# EasyEDA schematic SCH_BMS_1_2022-05-24.json
TITLE: Sheet_1; REV: 1.0; Date: 2021-11-02; Sheet: 1/1; Company: Your Company
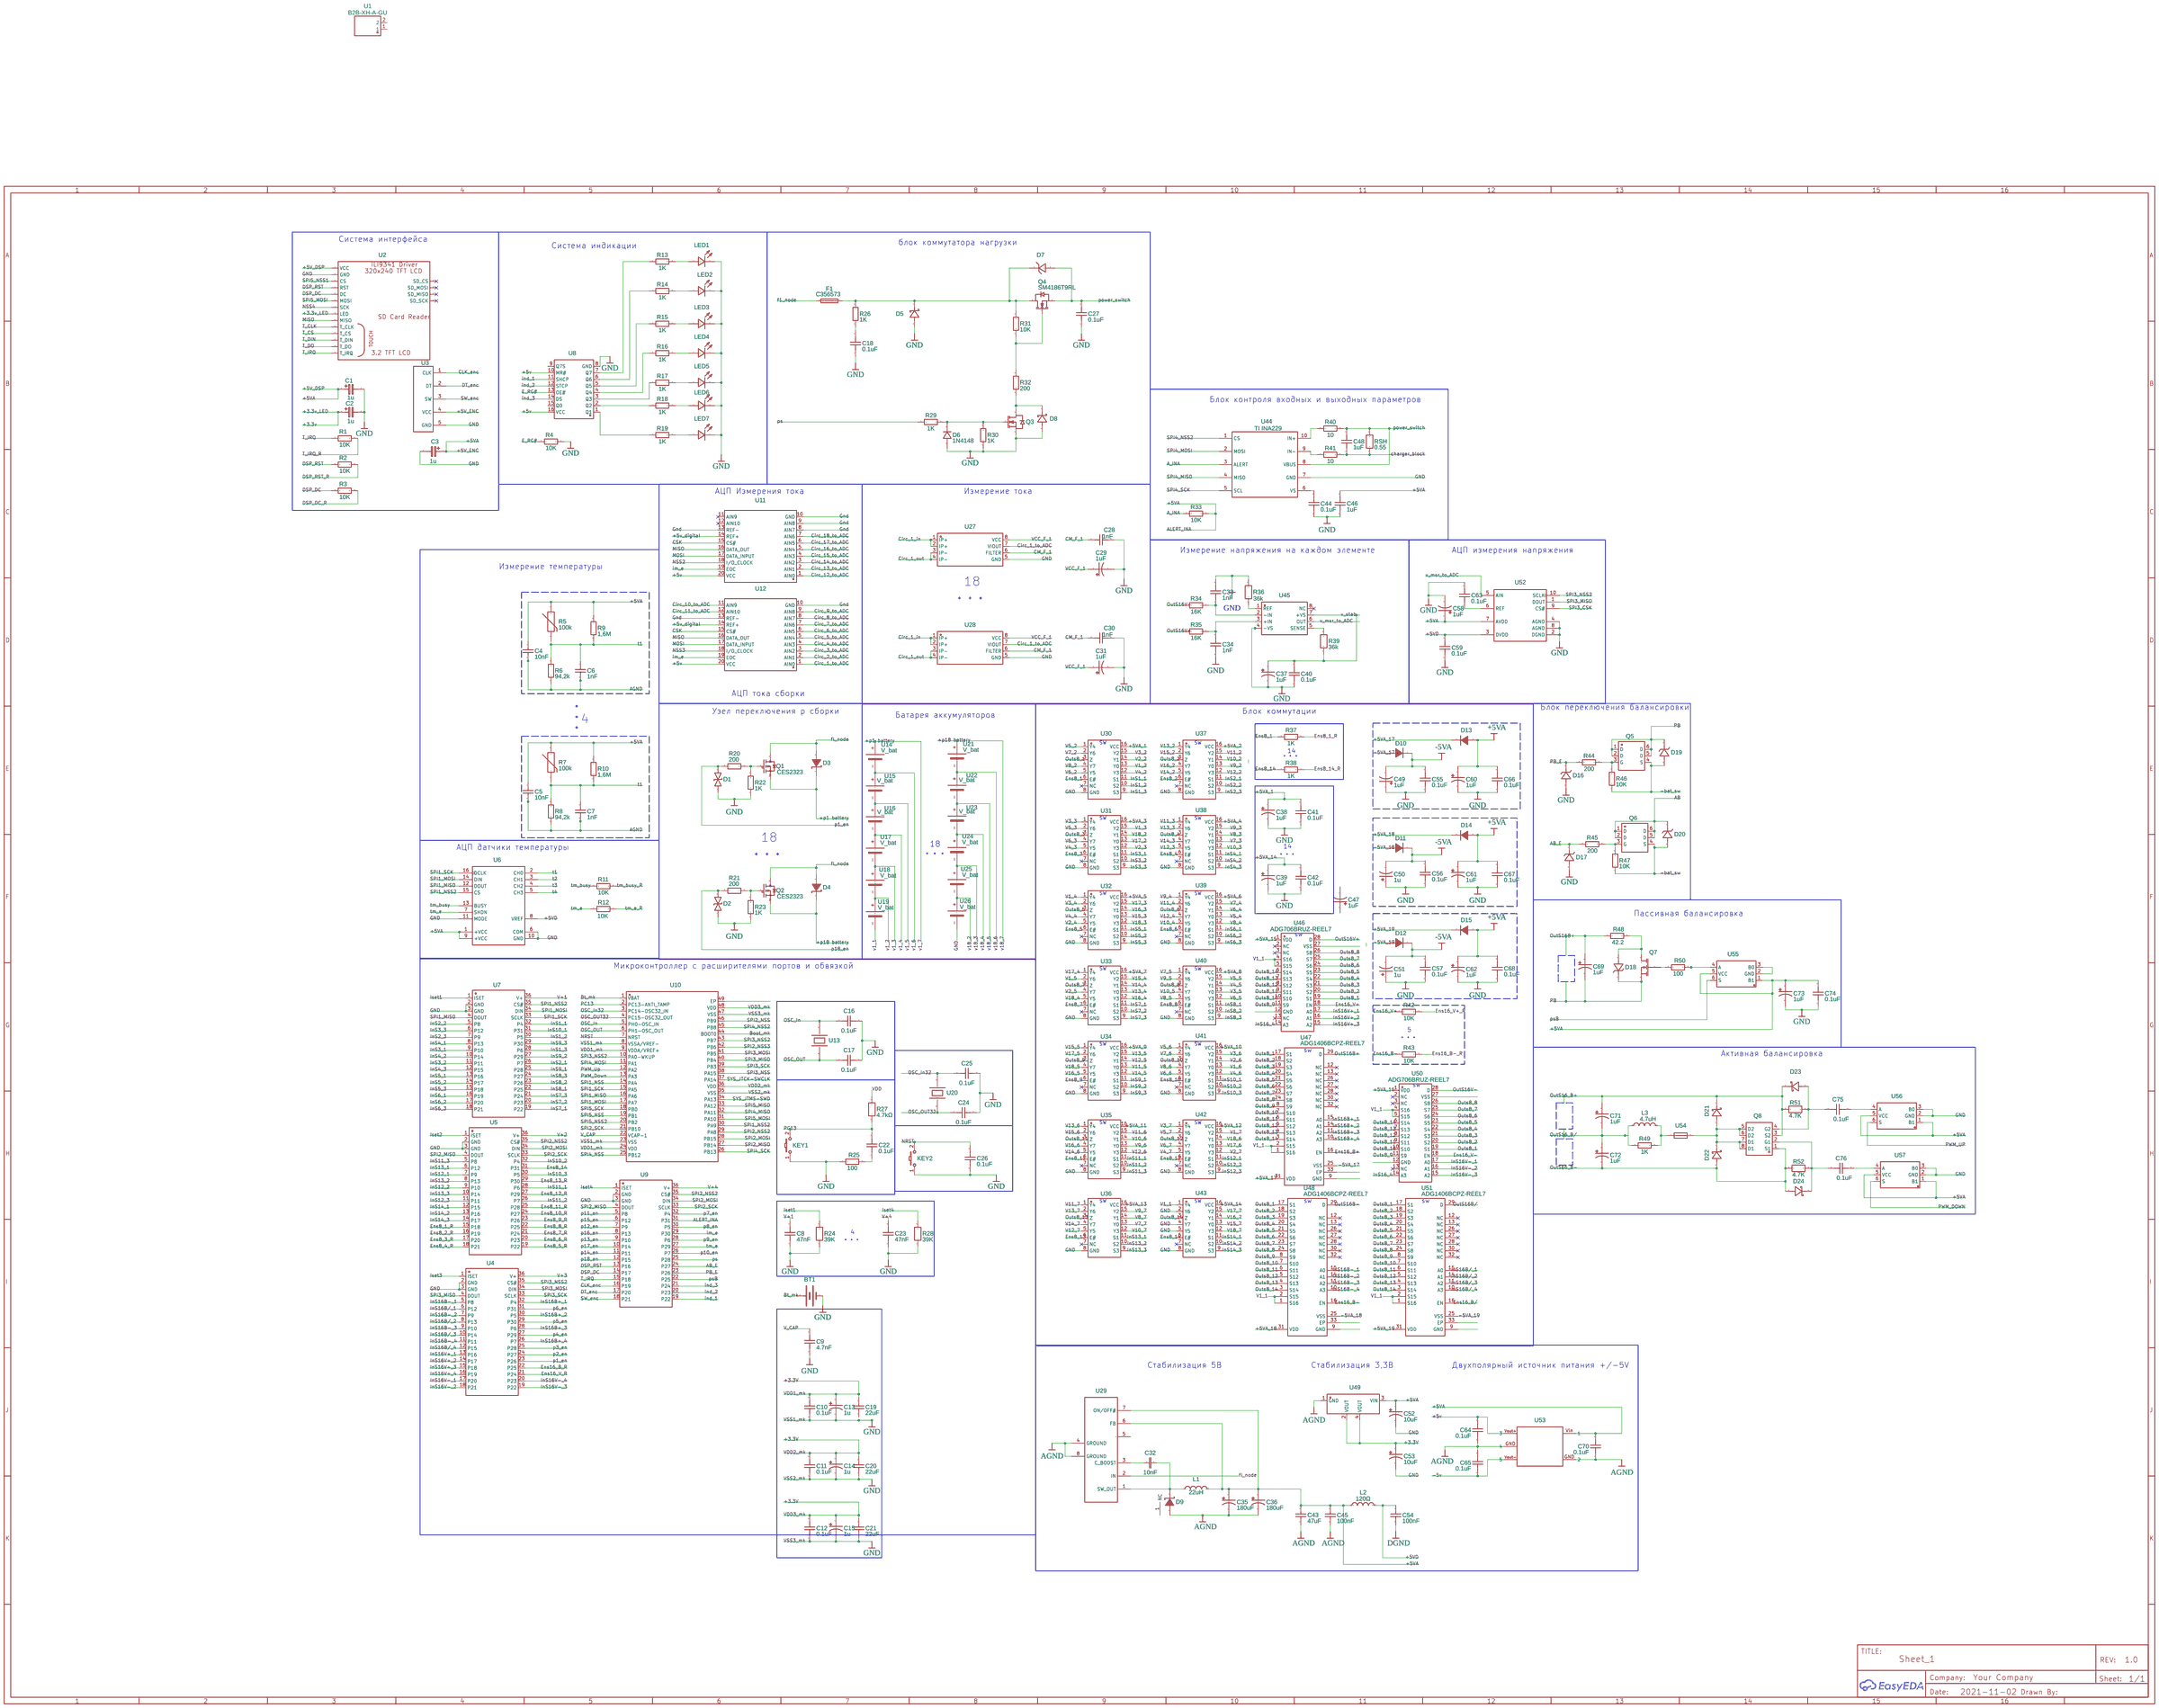
[diagram p0: schematic sheet]

## Parts
BT1  1025  [BAT-TH_KEYSTONE-1025]
C1  1u  [CASE-A_3216]
C2  1u  [CASE-A_3216]
C3  1u  [CASE-A_3216]
C4  10nF  [C0201]
C5  10nF  [C0201]
C6  1nF  [C0201]
C7  1nF  [C0201]
C8  47nF  [C0201]
C9  4.7nF  [C0201]
C10  0.1uF  [C0402]
C11  0.1uF  [C0402]
C12  0.1uF  [C0402]
C13  1u  [CAP-SMD_BD10.0-L10.3-W10.3-LS11.0-FD_16SVP180MX]
C14  1u  [CAP-SMD_BD10.0-L10.3-W10.3-LS11.0-FD_16SVP180MX]
C15  1u  [CAP-SMD_BD10.0-L10.3-W10.3-LS11.0-FD_16SVP180MX]
C16  0.1uF  [C0402]
C17  0.1uF  [C0402]
C18  0.1uF  [C0603]
C19  22uF  [C0603]
C20  22uF  [C0603]
C21  22uF  [C0603]
C22  0.1uF  [C0402]
C23  47nF  [C0201]
C24  0.1uF  [C0402]
C25  0.1uF  [C0402]
C26  0.1uF  [C0402]
C27  0.1uF  [C0603]
C28  1nF  [C0201]
C29  1uF  [CAP-SMD_L3.2-W1.6-R-RD]
C30  1nF  [C0201]
C31  1uF  [CAP-SMD_L3.2-W1.6-R-RD]
C32  10nF  [C0201]
C33  1nF  [C0201]
C34  1nF  [C0201]
C35  180uF  [CAP-SMD_BD10.0-L10.3-W10.3-LS11.0-R-RD]
C36  180uF  [CAP-SMD_BD10.0-L10.3-W10.3-LS11.0-R-RD]
C37  1uF  [CAP-SMD_BD4.0-L4.3-W4.3-FD]
C38  1uF  [CAP-SMD_BD4.0-L4.3-W4.3-FD]
C39  1uF  [CAP-SMD_BD4.0-L4.3-W4.3-FD]
C40  0.1uF  [C0402]
C41  0.1uF  [C0402]
C42  0.1uF  [C0402]
C43  47uF  [C0805]
C44  0.1uF  [C0402]
C45  100nF  [C0201]
C46  1uF  [C0603]
C47  1uF  [CAP-SMD_BD4.0-L4.3-W4.3-FD]
C48  1uF  [C0603]
C49  1uF  [CAP-SMD_BD4.0-L4.3-W4.3-FD]
C50  1u  [CASE-A_3216]
C51  1u  [CASE-A_3216]
C52  10uF  [CAP-SMD_BD3.0-L3.3-W3.3-FD]
C53  10uF  [CAP-SMD_BD3.0-L3.3-W3.3-FD]
C54  100nF  [C0201]
C55  0.1uF  [C0402]
C56  0.1uF  [C0402]
C57  0.1uF  [C0402]
C58  1uF  [CAP-SMD_BD4.0-L4.3-W4.3-FD]
C59  0.1uF  [C0402]
C60  1uF  [CAP-SMD_BD4.0-L4.3-W4.3-FD]
C61  1uF  [CAP-SMD_BD4.0-L4.3-W4.3-FD]
C62  1uF  [CAP-SMD_BD4.0-L4.3-W4.3-FD]
C63  0.1uF  [C0402]
C64  0.1uF  [C0402]
C65  0.1uF  [C0402]
C66  0.1uF  [C0402]
C67  0.1uF  [C0402]
C68  0.1uF  [C0402]
C69  1uF  [CAP-SMD_BD4.0-L4.3-W4.3-FD]
C70  0.1uF  [C0402]
C71  1uF  [CAP-SMD_BD4.0-L4.3-W4.3-FD]
C72  1uF  [CAP-SMD_BD4.0-L4.3-W4.3-FD]
C73  1uF  [CAP-SMD_BD4.0-L4.3-W4.3-FD]
C74  0.1uF  [C0402]
C75  0.1uF  [C0402]
C76  0.1uF  [C0402]
D1  UCLAMP0541Z.TFT  [D0201-BI_1]
D2  UCLAMP0541Z.TFT  [D0201-BI_1]
D3  1.0SMBJ30A  [SMB_L4.6-W3.6-LS5.3-RD]
D4  1.0SMBJ30A  [SMB_L4.6-W3.6-LS5.3-RD]
D5  PMEG3020EGWJ  [SOD-123_L2.8-W1.8-LS3.7-RD]
D6  1N4148  [DO-35_BD2.0-L4.0-P8.00-D0.5-FD]
D7  1SMAF4751A_C475445  [SMAF_L3.5-W2.6-LS4.7-RD]
D8  PMEG3020EGWJ  [SOD-123_L2.8-W1.8-LS3.7-RD]
D9  VS-6TQ045SPBF  [TO-263-2_L10.0-W9.1-P5.08-LS15.2-BR]
D10  WSB5557Z-2/TR  [DFN0603-D_L0.6-W0.3-P0.34-RD]
D11  WSB5557Z-2/TR  [DFN0603-D_L0.6-W0.3-P0.34-RD]
D12  WSB5557Z-2/TR  [DFN0603-D_L0.6-W0.3-P0.34-RD]
D13  WSB5557Z-2/TR  [DFN0603-D_L0.6-W0.3-P0.34-RD]
D14  WSB5557Z-2/TR  [DFN0603-D_L0.6-W0.3-P0.34-RD]
D15  WSB5557Z-2/TR  [DFN0603-D_L0.6-W0.3-P0.34-RD]
D16  MMSZ5233BS-7-F  [SOD-323_L1.8-W1.3-LS2.5-RD]
D17  MMSZ5233BS-7-F  [SOD-323_L1.8-W1.3-LS2.5-RD]
D18  BZT52B10S RRG  [SOD-323_L1.7-W1.3-LS2.6-RD]
D19  BZT52B10S RRG  [SOD-323_L1.7-W1.3-LS2.6-RD]
D20  BZT52B10S RRG  [SOD-323_L1.7-W1.3-LS2.6-RD]
D21  PMEG3020EGWJ  [SOD-123_L2.8-W1.8-LS3.7-RD]
D22  PMEG3020EGWJ  [SOD-123_L2.8-W1.8-LS3.7-RD]
D23  PMEG3020EGWJ  [SOD-123_L2.8-W1.8-LS3.7-RD]
D24  PMEG3020EGWJ  [SOD-123_L2.8-W1.8-LS3.7-RD]
F1  C356573  [FUSE-SMD_L6.1-W2.6]
KEY1  K2-3.6×6.1_SMD  [KEY-SMD_2P-L6.2-W3.6-LS8.0]
KEY2  K2-3.6×6.1_SMD  [KEY-SMD_2P-L6.2-W3.6-LS8.0]
L1  22uH  [IND-SMD_L4.0-W4.0]
L2  120Ω  [L0805]
L3  4.7uH  [IND-SMD_L4.0-W4.0]
LED1  LED-0603_R  [LED0603_RED]
LED2  LED-0603_R  [LED0603_RED]
LED3  LED-0603_R  [LED0603_RED]
LED4  LED-0603_R  [LED0603_RED]
LED5  LED-0603_R  [LED0603_RED]
LED6  LED-0603_R  [LED0603_RED]
LED7  LED-0603_R  [LED0603_RED]
Q1  CES2323  [SOT-23_L2.9-W1.3-P1.90-LS2.4-BR]
Q2  CES2323  [SOT-23_L2.9-W1.3-P1.90-LS2.4-BR]
Q3  SM2326NSANC-TRG  [SOT-23_L2.9-W1.3-P1.90-LS2.4-BR]
Q4  SM4186T9RL  [PG-TO252-3_L6.5-W6.2-P4.57-LS10.0-BR-CW]
Q5  SI1422DH-T1-GE3  [SC-70-6_L2.2-W1.3-P0.65-LS2.1-BL]
Q6  SI1422DH-T1-GE3  [SC-70-6_L2.2-W1.3-P0.65-LS2.1-BL]
Q7  MTN003N02Y3  [SOT-23-3]
Q8  FDS4897A  [SOP-8_L5.0-W4.0-P1.27-LS6.0-BL]
R1  10K  [R0603]
R2  10K  [R0603]
R3  10K  [R0603]
R4  10K  [R0603]
R5  100k  [RES-TH_L2.5-W2.5-P1.70-D0.3]
R6  94,2k  [R0201]
R7  100k  [RES-TH_L2.5-W2.5-P1.70-D0.3]
R8  94,2k  [R0201]
R9  1,6M  [R1206]
R10  1,6M  [R1206]
R11  10K  [R0603]
R12  10K  [R0603]
R13  1K  [R1206]
R14  1K  [R1206]
R15  1K  [R1206]
R16  1K  [R1206]
R17  1K  [R1206]
R18  1K  [R1206]
R19  1K  [R1206]
R20  200  [R1206]
R21  200  [R1206]
R22  1K  [R1206]
R23  1K  [R1206]
R24  39K  [R0805]
R25  100  [R1206]
R26  1K  [R1206]
R27  4.7kΩ  [R0805]
R28  39K  [R0805]
R29  1K  [R1206]
R30  1K  [R1206]
R31  10K  [R0603]
R32  200  [R1206]
R33  10K  [R0402]
R34  16K  [R1206]
R35  16K  [R1206]
R36  36k  [R1206]
R37  1K  [R0201]
R38  1K  [R0201]
R39  36k  [R1206]
R40  10  [R1206]
R41  10  [R1206]
R42  10K  [R0201]
R43  10K  [R0201]
R44  200  [R1206]
R45  200  [R1206]
R46  10K  [R0201]
R47  10K  [R0201]
R48  42.2  [R2512]
R49  1K  [R1218]
R50  100  [R1206]
R51  4.7K  [R0402]
R52  4.7K  [R0402]
RSH  0.55  [R0603]
U1  B2B-XH-A-GU  [CONN-TH_B2B-XH-A-GU]
U2  3.2_TFT_LCD_SPI_TOUCH  [ILI9341-3.2]
U3  Rotary_encoder_module  [ROTARY ENCODER MODULE]
U4  MAX7301AAX+  [SSOP-36_L15.4-W7.5-P0.80-LS10.3-BL]
U5  MAX7301AAX+  [SSOP-36_L15.4-W7.5-P0.80-LS10.3-BL]
U6  ADS7841E/2K5  [SSOP-16_L4.9-W3.9-P0.64-LS6.0-BL]
U7  MAX7301AAX+  [SSOP-36_L15.4-W7.5-P0.80-LS10.3-BL]
U8  74HC595PW,112  [TSSOP-16_L5.0-W4.4-P0.65-LS6.4-BL]
U9  MAX7301AAX+  [SSOP-36_L15.4-W7.5-P0.80-LS10.3-BL]
U10  STM32F411CCU6TR  [QFN-48_L7.0-W7.0-P0.50-BL-EP5.1]
U11  TLC2543N  [DIP-20_L26.8-W6.4-P2.54-LS7.6-BL]
U12  TLC2543N  [DIP-20_L26.8-W6.4-P2.54-LS7.6-BL]
U13  SMAQ-7050A  [IQG7050A]
U14  V_bat
U15  V_bat
U16  V_bat
U17  V_bat
U18  V_bat
U19  V_bat
U20  SMAQ-7050A  [IQG7050A]
U21  V_bat
U22  V_bat
U23  V_bat
U24  V_bat
U25  V_bat
U26  V_bat
U27  ACS714LLCTR-50A-T  [SOIC-8_L5.0-W4.0-P1.27-LS6.0-TL]
U28  ACS714LLCTR-50A-T  [SOIC-8_L5.0-W4.0-P1.27-LS6.0-TL]
U29  LM2678SX-ADJ/NOPB  [TO-263-7_L10.2-W8.7-P1.27-LS14.4-BR]
U30  NX3L4051PW,118  [TSSOP-16_L5.0-W4.4-P0.65-LS6.4-TL]
U31  NX3L4051PW,118  [TSSOP-16_L5.0-W4.4-P0.65-LS6.4-TL]
U32  NX3L4051PW,118  [TSSOP-16_L5.0-W4.4-P0.65-LS6.4-TL]
U33  NX3L4051PW,118  [TSSOP-16_L5.0-W4.4-P0.65-LS6.4-TL]
U34  NX3L4051PW,118  [TSSOP-16_L5.0-W4.4-P0.65-LS6.4-TL]
U35  NX3L4051PW,118  [TSSOP-16_L5.0-W4.4-P0.65-LS6.4-TL]
U36  NX3L4051PW,118  [TSSOP-16_L5.0-W4.4-P0.65-LS6.4-TL]
U37  NX3L4051PW,118  [TSSOP-16_L5.0-W4.4-P0.65-LS6.4-TL]
U38  NX3L4051PW,118  [TSSOP-16_L5.0-W4.4-P0.65-LS6.4-TL]
U39  NX3L4051PW,118  [TSSOP-16_L5.0-W4.4-P0.65-LS6.4-TL]
U40  NX3L4051PW,118  [TSSOP-16_L5.0-W4.4-P0.65-LS6.4-TL]
U41  NX3L4051PW,118  [TSSOP-16_L5.0-W4.4-P0.65-LS6.4-TL]
U42  NX3L4051PW,118  [TSSOP-16_L5.0-W4.4-P0.65-LS6.4-TL]
U43  NX3L4051PW,118  [TSSOP-16_L5.0-W4.4-P0.65-LS6.4-TL]
U44  TI INA229  [TI INA229]
U45  AD8278ARZ-R7  [SOIC-8_L5.0-W4.0-P1.27-LS6.0-BL]
U46  ADG706BRUZ-REEL7  [TSSOP-28_L9.7-W4.4-P0.65-LS6.4-BL]
U47  ADG1406BCPZ-REEL7  [QFN32-5*5_N-ADI-CP-32-2_N]
U48  ADG1406BCPZ-REEL7  [QFN32-5*5_N-ADI-CP-32-2_N]
U49  AIC1117A-25GYTR  [SOT-223_L6.5-W3.5-P2.30-LS7.0-BR]
U50  ADG706BRUZ-REEL7  [TSSOP-28_L9.7-W4.4-P0.65-LS6.4-BL]
U51  ADG1406BCPZ-REEL7  [QFN32-5*5_N-ADI-CP-32-2_N]
U52  MAX11100EUB+  [MSOP-10_L3.0-W3.0-P0.50-LS5.0-BL]
U53  DD1718PA
U54  0435002.KR  [F0402]
U55  NLAS4157DFT2G  [SC-88-6_L2.0-W1.3-P0.65-LS2.1-BL]
U56  NLAS4157DFT2G  [SC-88-6_L2.0-W1.3-P0.65-LS2.1-BL]
U57  NLAS4157DFT2G  [SC-88-6_L2.0-W1.3-P0.65-LS2.1-BL]

## Library data of the parts
BT1 = 1025: Supplier: LCSC; Supplier Part: C238060; Manufacturer: Keystone; Contributor: LCSC; JLCPCB Part Class: Extended Part; Package Display: No
C1-C3 = C_Tan_SMD_A_EU: Contributor: LCEDA_Lib
C4-C7 = GRM033R71A103KA01D: Supplier: LCSC; Manufacturer: MuRata; Supplier Part: C76941
C8 C23 = GRT033R60J473KE01D: Supplier: LCSC; Supplier Part: C126621; Manufacturer: Murata Electronics; Contributor: LCSC; JLCPCB Part Class: Extended Part; Package Display: No
C9 = CC0201KRX7R5BB472: Supplier: LCSC; Supplier Part: C526949; Manufacturer: YAGEO; Contributor: LCSC; Package Display: No
C10-C12 C16 C17 C22 C24-C26 C40-C42 C44 C55-C57 C59 C63-C68 C70 C74-C76 = 0402BB104K160NGT: Supplier: LCSC; Supplier Part: C2173076; Manufacturer: Knowles(楼氏); JLCPCB Part Class: Extended Part; Contributor: LCSC; Package Display: No
C13-C15 = 16SVP180MX: Supplier: LCSC; Supplier Part: C236288; Manufacturer: PANASONIC; Contributor: LCSC; JLCPCB Part Class: Extended Part
C18 C27 = 0603BB104K500NGT: Supplier: LCSC; Supplier Part: C2168571; Manufacturer: Knowles(楼氏); JLCPCB Part Class: Extended Part; Contributor: LCSC; Package Display: No
C19-C21 = GRM188B30J226MEA0D: Supplier: LCSC; Manufacturer: MuRata; Supplier Part: C15500; JLCPCB Part Class: Extended Part; Package Display: No
C28 C30 C33 C34 = 0201B102J500CT: Supplier: LCSC; Supplier Part: C458605; Manufacturer: Walsin Tech Corp; Contributor: LCSC
C29 C31 = CA45-A-16V-1UF-K: Supplier: LCSC; Supplier Part: C140386; Manufacturer: Shenzhen Zhenhua XinYun Elec; Manufacturer Part: CA45-A-16V-1uF-K; Contributor: LCSC; JLCPCB Part Class: Extended Part
C32 = C0603X5R103KDT: Supplier: LCSC; Supplier Part: C258479; Manufacturer: Darfon Elec; Contributor: LCSC; JLCPCB Part Class: Extended Part; Package Display: No
C35 C36 = PCV1V181MCL2GS: Supplier: LCSC; Supplier Part: C488000; Manufacturer: Nichicon; Contributor: LCSC; Package Display: No
C37-C39 C47 C49 C58 C60-C62 C69 C71-C73 = VE-010M1C0405-TRO: Supplier: LCSC; Supplier Part: C249445; Manufacturer: Lelon; Contributor: LCSC; JLCPCB Part Class: Extended Part; Package Display: No
C43 = 0805X476M6R3: Supplier: LCSC; Manufacturer: WTC; Supplier Part: C98821; Package Display: No
C45 C54 = C0201X6S104K6R3NTA: Supplier: LCSC; Supplier Part: C357757; Manufacturer: Shenzhen Eyang Tech Development; Contributor: LCSC; Package Display: No
C46 C48 = CL10F105ZP8NNNC: Supplier: LCSC; Manufacturer: SAMSUNG; Supplier Part: C84710; JLCPCB Part Class: Extended Part; Package Display: No
C50 C51 = C_Tan_SMD_A_US: Contributor: LCEDA_Lib; Package Display: No
C52 C53 = VE-100M0J0305-TRO: Supplier: LCSC; Supplier Part: C249448; Manufacturer: Lelon; Contributor: LCSC; JLCPCB Part Class: Extended Part; Package Display: No
D1 D2 = UCLAMP0541Z.TFT: Supplier: LCSC; Supplier Part: C193630; Manufacturer: SEMTECH; Contributor: LCSC; JLCPCB Part Class: Extended Part; Package Display: No
D3 D4 = 1.0SMBJ20A: Supplier: LCSC; Supplier Part: C501367; Manufacturer: Me-TECH; Contributor: LCSC; JLCPCB Part Class: Extended Part
D5 D8 D21-D24 = PMEG3020EGWJ: Supplier: LCSC; Supplier Part: C552875; Manufacturer: Nexperia; Contributor: LCSC; JLCPCB Part Class: Extended Part
D6 = 1N4148: Supplier: LCSC; Manufacturer: SEMTECH; Supplier Part: C14516; Contributor: LCEDA_Lib; Package Display: No
D7 = 1SMAF4751A_C475445: Supplier: LCSC; Supplier Part: C475445; Manufacturer: Shikues; Manufacturer Part: 1SMAF4751A; Contributor: LCSC; JLCPCB Part Class: Extended Part; Package Display: No
D9 = VS-6TQ045SPBF: Supplier: LCSC; Manufacturer: VISHAY; Contributor: LCSC; Supplier Part: C145462; JLCPCB Part Class: Extended Part
D10-D15 = WSB5557Z-2/TR: Supplier: LCSC; Supplier Part: C239812; Manufacturer: Will Semicon; Contributor: LCSC; JLCPCB Part Class: Extended Part; Package Display: No
D16 D17 = MMSZ5233BS-7-F: Supplier: LCSC; Supplier Part: C508230; Manufacturer: Diodes Incorporated; Contributor: LCSC; JLCPCB Part Class: Extended Part; Package Display: No
D18-D20 = BZT52B10S RRG: Supplier: LCSC; Supplier Part: C485479; Manufacturer: Taiwan Semiconductor(Taiwan Semicon); Contributor: LCSC; JLCPCB Part Class: Extended Part; Package Display: No
F1 = 25F-100H: Supplier: LCSC; Manufacturer: HOLLY; Contributor: LCSC; JLCPCB Part Class: Extended Part
KEY1 KEY2 = K2-3.6×6.1_SMD: Supplier Part: C118141; Supplier: LCSC; Manufacturer Part: K2-1107ST-A4SW-06; Contributor: LCEDA_Lib; 制造商: 韩国韩荣; Package Display: No
L1 = LQH44PN220MP0L: Supplier: LCSC; Supplier Part: C341778; Manufacturer: Murata Electronics; Contributor: LCSC
L2 = BLM21PG121SZ1D: Supplier: LCSC; Manufacturer: MuRata; Contributor: LCSC; Supplier Part: C160987; JLCPCB Part Class: Extended Part; Package Display: No
L3 = CKCS4030-4.7UH/M-2131: Supplier: LCSC; Supplier Part: C354588; Manufacturer: CENKER; Manufacturer Part: CKCS4030-4.7uH/M-2131; Contributor: LCSC
LED1-LED7 = LED-0603_R: Manufacturer: EVERLIGHT(台湾亿光); Manufacturer Part: 19-217/R6C-AL1M2VY/3T; Supplier Part: C72044; Supplier: LCSC; Contributor: LCEDA_01
Q1 Q2 = CES2323: Supplier: LCSC; Manufacturer: CET; Contributor: LCSC; Supplier Part: C83044; JLCPCB Part Class: Extended Part; Package Display: No
Q3 = SM2326NSANC-TRG: Supplier: LCSC; Supplier Part: C368561; Manufacturer: Sinopower Semicon; Contributor: LCSC; JLCPCB Part Class: Extended Part; Package Display: No
Q4 = SM4186T9RL: Supplier: LCSC; Supplier Part: C496601; Manufacturer: SPS; Contributor: LCSC; JLCPCB Part Class: Extended Part; Package Display: No
Q5 Q6 = SI1422DH-T1-GE3: Supplier: LCSC; Manufacturer: VISHAY; Contributor: LCSC; Supplier Part: C144842; JLCPCB Part Class: Extended Part; Package Display: No
Q7 = SLS2302: Contributor: Jesseprominer
Q8 = FDS4897A: Supplier: LCSC; Supplier Part: C693180; Manufacturer: VBsemi Elec; Contributor: LCSC; JLCPCB Part Class: Extended Part
R1-R4 R11 R12 R31 = 0603WAF1002T5E: Supplier: LCSC; Manufacturer: UniOhm; Supplier Part: C25804; JLCPCB Part Class: Basic Part; Package Display: No
R5 R7 = MF52A1104F3950(P209-15A): Supplier: LCSC; Manufacturer: Shiheng; Supplier Part: C13424; JLCPCB Part Class: Extended Part; Package Display: No
R6 R8 = WR02X1873FAL: Supplier: LCSC; Supplier Part: C171920; Manufacturer: Huaxin S&T; Contributor: LCSC; JLCPCB Part Class: Extended Part; Package Display: No
R9 R10 = CR1206-FX-1603ELF: Supplier: LCSC; Supplier Part: C204681; Manufacturer: BOURNS; Contributor: LCSC; JLCPCB Part Class: Extended Part; Package Display: No
R13-R19 R22 R23 R26 = CR1206F41001G: Supplier: LCSC; Manufacturer: LIZ; Supplier Part: C102060; JLCPCB Part Class: Extended Part; Package Display: No
R20 R21 R32 R44 R45 = RMC12062005%N: Supplier: LCSC; Supplier Part: C269602; Manufacturer: Tyohm; Contributor: LCSC; JLCPCB Part Class: Extended Part; Package Display: No
R24 R28 = ERJ6ENF3902V: Supplier: LCSC; Supplier Part: C413307; Manufacturer: PANASONIC; Contributor: LCSC; Package Display: No
R25 = CR1206F100RP05: Supplier: LCSC; Supplier Part: C245445; Manufacturer: Ever Ohms Tech; Contributor: LCSC; JLCPCB Part Class: Extended Part; Package Display: No
R27 = RK73G2ATTD4701F: Supplier: LCSC; Supplier Part: C516091; Manufacturer: KOA Speer Elec; Contributor: LCSC; Package Display: No
R29 R30 = RMC12061K5%N: Supplier: LCSC; Supplier Part: C269755; Manufacturer: Tyohm; Contributor: LCSC; JLCPCB Part Class: Extended Part; Package Display: No
R33 = RNCF0402BTE10K0: Supplier: LCSC; Supplier Part: C346559; Manufacturer: Stackpole Elec; Contributor: LCSC; JLCPCB Part Class: Extended Part; Package Display: No
R34 R35 = CR1206-FX-1602ELF: Supplier: LCSC; Supplier Part: C204680; Manufacturer: BOURNS; Contributor: LCSC; JLCPCB Part Class: Extended Part; Package Display: No
R36 R39 = RK73H2BTTD3602F: Supplier: LCSC; Supplier Part: C880208; Manufacturer: KOA Speer Elec; Contributor: LCSC; Package Display: No
R37 R38 R42 R43 R46 R47 = RC-01W103JT: Supplier: LCSC; Supplier Part: C304504; Manufacturer: Guangdong Fenghua Advanced Tech; Contributor: LCSC; Package Display: No
R40 R41 = RMC1206101%N: Supplier: LCSC; Supplier Part: C269633; Manufacturer: Tyohm; Contributor: LCSC; JLCPCB Part Class: Extended Part; Package Display: No
R48 = RC-12K42R2FT: Supplier: LCSC; Supplier Part: C454007; Manufacturer: FH(Guangdong Fenghua Advanced Tech); Contributor: LCSC; Package Display: No
R49 = TR1218F1KE0450: Supplier: LCSC; Supplier Part: C175641; Manufacturer: Ever Ohms Tech; Contributor: LCSC; JLCPCB Part Class: Extended Part; Package Display: No
R50 = FCR1206J100RP055W: Supplier: LCSC; Supplier Part: C153338; Manufacturer: Ever Ohms Tech; Contributor: LCSC; JLCPCB Part Class: Extended Part; Package Display: No
R51 = ERJPA2J472X: Supplier: LCSC; Supplier Part: C427213; Manufacturer: PANASONIC; Manufacturer Part: К; Contributor: LCSC; Package Display: No
R52 = ERJPA2J472X: Supplier: LCSC; Supplier Part: C427213; Manufacturer: PANASONIC; Contributor: LCSC; Package Display: No
RSH = R_0603_EU: Contributor: LCEDA_Lib; Manufacturer Part: CSS1206DT50L0; Manufacturer: SEI(Stackpole Elec)
U1 = B2B-XH-A-GU: Supplier: LCSC; Supplier Part: C265283; Manufacturer: JST Sales America; Contributor: LCSC; JLCPCB Part Class: Extended Part
U2 = 3.2_TFT_LCD_SPI_TOUCH: Contributor: Martí B
U3 = Rotary_encoder_module: Supplier Part: undefined; Contributor: Geerten1997
U4 U5 U7 U9 = MAX7301AAX+: Supplier: LCSC; Manufacturer: MAXIM; Contributor: LCSC; Supplier Part: C143583; JLCPCB Part Class: Extended Part; Package Display: No
U6 = ADS7841E/2K5: Supplier: LCSC; Manufacturer: TI; Supplier Part: C41778; JLCPCB Part Class: Extended Part; Package Display: No
U8 = 74HC595PW,112: Supplier: LCSC; Supplier Part: C547128; Manufacturer: Nexperia; Contributor: LCSC; JLCPCB Part Class: Extended Part
U10 = STM32F411CCU6TR: Supplier: LCSC; Supplier Part: C190642; Manufacturer: STMicroelectronics; Contributor: LCSC; JLCPCB Part Class: Extended Part
U11 U12 = TLC2543N: Supplier: LCSC; Supplier Part: C398066; Manufacturer: HGSEMI; Contributor: LCSC; JLCPCB Part Class: Extended Part; Package Display: No
U13 U20 = SMAQ-7050A: Package Display: No
U14-U19 U21-U26 = V_bat: catid: 20; Contributor: sergeydavidenko3461; sim: true
U27 U28 = ACS714LLCTR-50A-T: Supplier: LCSC; Supplier Part: C163302; Manufacturer: Allegro MicroSystems, LLC; Contributor: LCSC; JLCPCB Part Class: Extended Part
U29 = LM2678SX-ADJ/NOPB: Supplier: LCSC; Manufacturer: TI; Supplier Part: C40844; JLCPCB Part Class: Extended Part
U30-U43 = NX3L4051PW,118: Supplier: LCSC; Supplier Part: C2673441; Manufacturer: NXP(恩智浦); Contributor: LCSC; JLCPCB Part Class: Extended Part; Package Display: No
U44 = TI INA229: Manufacturer: Texas Instruments; Manufacturer Part: INA229; link: http://www.ti.com/product/INA229-Q1?dcmp=dsproject&hqs=pf; Contributor: part.jackpot
U45 = AD8278ARZ-R7: Supplier: LCSC; Supplier Part: C652635; Manufacturer: Analog Devices; Contributor: LCSC; JLCPCB Part Class: Extended Part; Package Display: No
U46 U50 = ADG706BRUZ-REEL7: Supplier: LCSC; Supplier Part: C408400; Manufacturer: Analog Devices; Contributor: LCSC; JLCPCB Part Class: Extended Part; Package Display: No
U47 U48 U51 = ADG1406BCPZ-REEL7: 9.5 Ohm Ron, 16-Channel, +-15 V  +12 V  +-5 V iCMOS Multiplexer, 32-pin QFN (CP-32-2), Reel; Package Display: No
U49 = AIC1117A-25GYTR: Supplier: LCSC; Supplier Part: C238209; Manufacturer: Analog Integrations; Contributor: LCSC; JLCPCB Part Class: Extended Part; Package Display: No
U52 = MAX11100EUB+: Supplier: LCSC; Manufacturer: MAXIM; Contributor: LCSC; Supplier Part: C143329; JLCPCB Part Class: Extended Part; Package Display: No
U53 = DD1718PA: Contributor: Алексей Пичугов; Package Display: Yes
U54 = 0435002.KR: Supplier: LCSC; Supplier Part: C206948; Manufacturer: Littelfuse; Contributor: LCSC; JLCPCB Part Class: Extended Part; Package Display: No
U55-U57 = NLAS4157DFT2G: Supplier: LCSC; Supplier Part: C106912; Manufacturer: ON Semicon; Contributor: LCSC; JLCPCB Part Class: Extended Part

## Nets
+3.3V: C10.2 C11.2 C12.2 C13.1 C14.1 C15.1 C19.2 C20.2 C21.2 C53.1 U10.9(VDDA/VREF+) U10.24(VDD) U10.36(VDD) U10.48(VDD) U49.2(VOUT) U49.4(VOUT)
+3.3v: C2.1 U2.8(LED)
+5v: C64.2 U8.10(MR#) U8.16(VCC) U11.20(VCC) U12.20(VCC)
+5v_digital: U11.14(REF+) U12.14(REF+)
+5VA: C1.1 C3.1 C4.1 C5.1 C35.1 C36.1 C43.2 C45.1 C46.2 C52.1 C58.1 C60.1 C61.1 C62.1 C66.2 C67.2 C70.2 C73.1 C74.2 D13.2(A) D14.2(A) D15.2(A) L1.2 L2.1 R5.2 R7.2 R9.2 R10.2 R33.1 U2.1(VCC) U3.4(VCC) U6.1(+VCC) U6.9(+VCC) U9.31(P31) U29.6(FB) U29.7(ON/OFF#) U49.3(VIN) U52.7(AVDD) U55.1(B1) U55.5(VCC) U56.1(B1) U56.5(VCC) U57.1(B1) U57.5(VCC)
+5VA_1: C38.1 C41.2 U30.16(VCC)
+5VA_2: U37.16(VCC)
+5VA_3: U31.16(VCC)
+5VA_4: U38.16(VCC)
+5VA_5: U32.16(VCC)
+5VA_6: U39.16(VCC)
+5VA_7: U33.16(VCC)
+5VA_8: U40.16(VCC)
+5VA_9: U34.16(VCC)
+5VA_10: U41.16(VCC)
+5VA_11: U35.16(VCC)
+5VA_12: U42.16(VCC)
+5VA_13: U36.16(VCC)
+5VA_14: C39.1 C42.2 U43.16(VCC)
+5VA_15: U46.1(VDD)
+5VA_16: U50.1(VDD)
+5VA_17: D13.1(K) U47.31(VDD)
+5VA_18: D14.1(K) U48.31(VDD)
+5VA_19: D15.1(K) U51.31(VDD)
+5VD: C54.1 C59.2 L2.2 U6.8(VREF) U52.3(DVDD)
-5v: C65.1
-5VA: C49.2 C50.2 C51.2 C55.2 D10.1(K) D11.1(K) D12.1(K)
-5VA_17: D10.2(A) U47.25(VSS)
-5VA_18: D11.2(A) U48.25(VSS)
-5VA_19: D12.2(A) U51.25(VSS)
AGND: C4.2 C5.2 C6.2 C7.2 C35.2 C36.2 C43.1 C45.2 C64.1 C65.2 C70.1 D9.3(A) R6.1 R8.1 U29.4(GROUND) U29.8(GROUND) U49.1(GND)
DGND: C54.2
GND: BT1.2(-) C1.2 C2.2 C3.2 C8.1 C9.1 C10.1 C11.1 C12.1 C13.2 C14.2 C15.2 C16.2 C17.2 C18.1 C20.1 C21.1 C23.1 C24.2 C25.2 C26.1 C27.1 C28.2 C29.2 C30.2 C31.2 C33.2 C34.1 C37.2 C38.2 C39.2 C40.1 C41.1 C42.1 C44.1 C46.1 C49.1 C50.1 C51.1 C52.2 C53.2 C55.1 C58.2 C59.1 C60.2 C61.2 C62.2 C63.2 C66.1 C67.1 C73.2 C74.1 D1.1(K) D2.1(K) D5.2(A) D6.1 D8.2(A) D16.2(A) D17.2(A) KEY1.1 KEY2.1 LED1.2 LED2.2 LED3.2 LED4.2 LED5.2 LED6.2 LED7.2 Q3.2(S) R4.2 R22.1 R23.1 R24.1 R25.1 R28.1 R30.1 R36.2 U2.2(GND) U3.5(GND) U4.2(GND) U4.3(GND) U5.2(GND) U5.3(GND) U6.6(COM) U6.10(GND) U6.11(MODE) U7.2(GND) U7.3(GND) U8.8(GND) U9.2(GND) U9.3(GND) U10.8(VSSA/VREF-) U10.23(VSS) U10.35(VSS) U10.47(VSS) U26.-(6) U27.5(GND) U28.5(GND) U30.8(GND) U31.8(GND) U32.8(GND) U33.8(GND) U34.8(GND) U35.8(GND) U36.8(GND) U37.8(GND) U38.8(GND) U39.8(GND) U40.8(GND) U41.8(GND) U42.8(GND) U43.2(Y6) U43.4(Y7) U43.5(Y5) U43.8(GND) U44.7(GND) U45.4(-VS) U52.2(DGND) U52.4(AGND) U52.8(AGND) U56.2(GND) U56.3(B0) U57.2(GND) U57.3(B0)
Gnd: U11.8(AIN7) U11.9(AIN8) U11.10(GND) U11.13(REF-) U12.10(GND) U12.13(REF-)
v1_1: U19.-(6)
V1_1: U43.1(Y4) U46.4(S16) U46.5(S15) U47.1(S16) U47.2(S15) U48.1(S16) U48.2(S15) U50.4(S16) U50.5(S15) U51.1(S16) U51.2(S15)
v1_2: U18.-(6) U19.+(5)
V1_2: U30.13(Y0)
v1_3: U17.-(6)
V1_3: U31.15(Y2)
v1_4: U16.-(6) U17.+(5)
V1_4: U32.1(Y4)
v1_5: U15.-(6) U16.+(5)
V1_5: U33.2(Y6)
v1_6: U14.-(6) U15.+(5)
V1_6: U41.13(Y0)
V1_7: U42.15(Y2)
V2_2: U30.14(Y1)
V2_3: U31.12(Y3)
V2_4: U32.5(Y5)
V2_5: U33.4(Y7)
V2_6: U41.14(Y1)
V2_7: U42.12(Y3)
V3_2: U30.15(Y2)
V3_3: U31.1(Y4)
V3_4: U32.2(Y6)
V3_5: U40.13(Y0)
V3_6: U41.15(Y2)
V3_7: U42.1(Y4)
V4_2: U30.12(Y3)
V4_3: U31.5(Y5)
V4_4: U32.4(Y7)
V4_5: U40.14(Y1)
V4_6: U41.12(Y3)
V4_7: U42.5(Y5)
V5_2: U30.1(Y4)
V5_3: U31.2(Y6)
V5_4: U39.13(Y0)
V5_5: U40.15(Y2)
V5_6: U41.1(Y4)
V5_7: U42.2(Y6)
V6_2: U30.5(Y5)
V6_3: U31.4(Y7)
V6_4: U39.14(Y1)
V6_5: U40.12(Y3)
V6_6: U41.5(Y5)
V6_7: U42.4(Y7)
V7_2: U30.2(Y6)
V7_3: U38.13(Y0)
V7_4: U39.15(Y2)
V7_5: U40.1(Y4)
V7_6: U41.2(Y6)
V7_7: U36.13(Y0)
V8_2: U30.4(Y7)
V8_3: U38.14(Y1)
V8_4: U39.12(Y3)
V8_5: U40.5(Y5)
V8_6: U41.4(Y7)
V8_7: U36.14(Y1)
V9_2: U37.13(Y0)
V9_3: U38.15(Y2)
V9_4: U39.1(Y4)
V9_5: U40.2(Y6)
V9_6: U35.13(Y0)
V9_7: U36.15(Y2)
V10_2: U37.14(Y1)
V10_3: U38.12(Y3)
V10_4: U39.5(Y5)
V10_5: U40.4(Y7)
V10_6: U35.14(Y1)
V10_7: U36.12(Y3)
V11_2: U37.15(Y2)
V11_3: U38.1(Y4)
V11_4: U39.2(Y6)
V11_5: U34.13(Y0)
V11_6: U35.15(Y2)
V11_7: U36.1(Y4)
V12_2: U37.12(Y3)
V12_3: U38.5(Y5)
V12_4: U39.4(Y7)
V12_5: U34.14(Y1)
V12_6: U35.12(Y3)
V12_7: U36.5(Y5)
V13_2: U37.1(Y4)
V13_3: U38.2(Y6)
V13_4: U33.13(Y0)
V13_5: U34.15(Y2)
V13_6: U35.1(Y4)
V13_7: U36.2(Y6)
V14_2: U37.5(Y5)
V14_3: U38.4(Y7)
V14_4: U33.14(Y1)
V14_5: U34.12(Y3)
V14_6: U35.5(Y5)
V14_7: U36.4(Y7)
V15_2: U37.2(Y6)
V15_3: U32.13(Y0)
V15_4: U33.15(Y2)
V15_5: U34.1(Y4)
V15_6: U35.2(Y6)
V15_7: U43.13(Y0)
V16_2: U37.4(Y7)
V16_3: U32.14(Y1)
V16_4: U33.12(Y3)
V16_5: U34.5(Y5)
V16_6: U35.4(Y7)
V16_7: U43.14(Y1)
V17_2: U31.13(Y0)
V17_3: U32.15(Y2)
V17_4: U33.1(Y4)
V17_5: U34.2(Y6)
V17_6: U42.13(Y0)
V17_7: U43.15(Y2)
v18_2: U25.-(6) U26.+(5)
V18_2: U31.14(Y1)
v18_3: U24.-(6)
V18_3: U32.12(Y3)
v18_4: U23.-(6) U24.+(5)
V18_4: U33.5(Y5)
v18_5: U22.-(6) U23.+(5)
V18_5: U34.4(Y7)
v18_6: U21.-(6) U22.+(5)
V18_6: U42.14(Y1)
V18_7: U43.12(Y3)
VCC_F_1: C29.1 C31.1 U27.8(VCC) U28.8(VCC)
VDD: R27.2
+p1 battery: D3.1(K) Q1.2(S) U14.+(5)
+p18 battery: D4.1(K) Q2.2(S) U21.+(5)
-bat_sw: D19.2(A) D20.2(A) Q5.4(S) Q6.4(S) R46.1 R47.1
A_INA: R33.2 U44.3(ALERT)
AB: D20.1(K) Q6.1(D) Q6.2(D) Q6.5(D) Q6.6(D)
AB_E: D17.1(K) R45.2 U9.24(P27)
Boot_mk: U10.44(BOOT0)
Bt_mk: BT1.1(+) U10.1(VBAT)
charger_block: C48.1 R41.2 RSH.1
Circ_1_in: U27.1(IP+) U27.2(IP+) U28.1(IP+) U28.2(IP+)
Circ_1_out: U27.3(IP-) U27.4(IP-) U28.3(IP-) U28.4(IP-)
Circ_1_to_ADC: U12.1(AIN0) U27.7(VIOUT) U28.7(VIOUT)
Circ_2_to_ADC: U12.2(AIN1)
Circ_3_to_ADC: U12.3(AIN2)
Circ_4_to_ADC: U12.4(AIN3)
Circ_5_to_ADC: U12.5(AIN4)
Circ_6_to_ADC: U12.6(AIN5)
Circ_7_to_ADC: U12.7(AIN6)
Circ_8_to_ADC: U12.8(AIN7)
Circ_9_to_ADC: U12.9(AIN8)
Circ_10_to_ADC: U12.11(AIN9)
Circ_11_to_ADC: U12.12(AIN10)
Circ_12_to_ADC: U11.1(AIN0)
Circ_13_to_ADC: U11.2(AIN1)
Circ_14_to_ADC: U11.3(AIN2)
Circ_15_to_ADC: U11.4(AIN3)
Circ_16_to_ADC: U11.5(AIN4)
Circ_17_to_ADC: U11.6(AIN5)
Circ_18_to_ADC: U11.7(AIN6)
CLK_enc: U3.1(CLK) U9.16(P19)
CM_F_1: C28.1 C30.1 U27.6(FILTER) U28.6(FILTER)
CSK: U11.15(CS#) U12.15(CS#)
DSP_DC: R3.1 U2.5(DC) U9.14(P17)
DSP_DC_R: R3.2
DSP_RST: R2.1 U2.4(RST) U9.13(P16)
DSP_RST_R: R2.2
DT_enc: U3.2(DT) U9.17(P20)
E_RG#: R4.1 U8.13(OE#)
Ens8_1: R37.1 U30.6(E#)
Ens8_1_R: R37.2 U5.15(P18)
Ens8_2: U37.6(E#)
Ens8_2_R: U5.16(P19)
Ens8_3: U31.6(E#)
Ens8_3_R: U5.17(P20)
Ens8_4: U38.6(E#)
Ens8_4_R: U5.18(P21)
Ens8_5: U32.6(E#)
Ens8_5_R: U5.19(P22)
Ens8_6: U39.6(E#)
Ens8_6_R: U5.20(P23)
Ens8_7: U33.6(E#)
Ens8_7_R: U5.21(P24)
Ens8_8: U40.6(E#)
Ens8_8_R: U5.22(P25)
Ens8_9: U34.6(E#)
Ens8_9_R: U5.23(P26)
Ens8_10: U41.6(E#)
Ens8_10_R: U5.24(P27)
Ens8_11: U35.6(E#)
Ens8_11_R: U5.25(P28)
Ens8_12: U42.6(E#)
Ens8_12_R: U5.27(P29)
Ens8_13: U36.6(E#)
Ens8_13_R: U5.29(P30)
Ens8_14: R38.1 U5.31(P31) U43.6(E#)
Ens8_14_R: R38.2
Ens16_B+: U47.16(EN)
Ens16_B-: R43.1 U48.16(EN)
Ens16_B-_R: R43.2
Ens16_B/: U51.16(EN)
Ens16_B_R: U4.22(P25)
Ens16_V+: R42.1 U46.18(EN)
Ens16_V+_R: R42.2
Ens16_V-: U50.18(EN)
Ens16_V_R: U4.21(P24)
f1_node: F1.1
fl_node: D3.2(A) D4.2(A) Q1.3(D) Q2.3(D) U29.2(IN)
im_e: U9.29(P30) U11.19(EOC) U12.19(EOC)
ind_1: U8.11(SHCP) U9.19(P22)
ind_2: U8.12(STCP) U9.20(P23)
ind_3: U8.14(DS) U9.21(P24)
InS1_1: U7.32(P4) U30.11(S1)
InS1_2: U7.30(P5) U30.10(S2)
InS1_3: U7.28(P6) U30.9(S3)
InS2_1: U7.26(P7) U37.11(S1)
InS2_2: U7.5(P8) U37.10(S2)
InS2_3: U7.7(P9) U37.9(S3)
InS3_1: U7.9(P10) U31.11(S1)
InS3_2: U7.11(P11) U31.10(S2)
InS3_3: U7.6(P12) U31.9(S3)
InS4_1: U7.8(P13) U38.11(S1)
InS4_2: U7.10(P14) U38.10(S2)
InS4_3: U7.12(P15) U38.9(S3)
InS5_1: U7.13(P16) U32.11(S1)
InS5_2: U7.14(P17) U32.10(S2)
InS5_3: U7.15(P18) U32.9(S3)
InS6_1: U7.16(P19) U39.11(S1)
InS6_2: U7.17(P20) U39.10(S2)
InS6_3: U7.18(P21) U39.9(S3)
InS7_1: U7.19(P22) U33.11(S1)
InS7_2: U7.20(P23) U33.10(S2)
InS7_3: U7.21(P24) U33.9(S3)
InS8_1: U7.22(P25) U40.11(S1)
InS8_2: U7.23(P26) U40.10(S2)
InS8_3: U7.24(P27) U40.9(S3)
InS9_1: U7.25(P28) U34.11(S1)
InS9_2: U7.27(P29) U34.10(S2)
InS9_3: U7.29(P30) U34.9(S3)
InS10_1: U7.31(P31) U41.11(S1)
InS10_2: U5.32(P4) U41.10(S2)
InS10_3: U5.30(P5) U41.9(S3)
InS11_1: U5.28(P6) U35.11(S1)
InS11_2: U5.26(P7) U35.10(S2)
InS11_3: U5.5(P8) U35.9(S3)
InS12_1: U5.7(P9) U42.11(S1)
InS12_2: U5.9(P10) U42.10(S2)
InS12_3: U5.11(P11) U42.9(S3)
InS13_1: U5.6(P12) U36.11(S1)
InS13_2: U5.8(P13) U36.10(S2)
InS13_3: U5.10(P14) U36.9(S3)
InS14_1: U5.12(P15) U43.11(S1)
InS14_2: U5.13(P16) U43.10(S2)
InS14_3: U5.14(P17) U43.9(S3)
InS16_4: U46.14(A3) U50.14(A3)
InS16B+_1: U4.32(P4) U47.15(A0)
InS16B+_2: U4.30(P5) U47.14(A1)
InS16B+_3: U4.28(P6) U47.11(A2)
InS16B+_4: U4.26(P7) U47.10(A3)
InS16B-_1: U4.5(P8) U48.15(A0)
InS16B-_2: U4.7(P9) U48.14(A1)
InS16B-_3: U4.9(P10) U48.11(A2)
InS16B-_4: U4.11(P11) U48.10(A3)
InS16B/_1: U4.6(P12) U51.15(A0)
InS16B/_2: U4.8(P13) U51.14(A1)
InS16B/_3: U4.10(P14) U51.11(A2)
InS16B/_4: U4.12(P15) U51.10(A3)
InS16V+_1: U4.13(P16) U46.17(A0)
InS16V+_2: U4.14(P17) U46.16(A1)
InS16V+_3: U4.15(P18) U46.15(A2)
InS16V+_4: U4.16(P19)
InS16V-_1: U4.17(P20) U50.17(A0)
InS16V-_2: U4.18(P21) U50.16(A1)
InS16V-_3: U4.19(P22) U50.15(A2)
InS16V-_4: U4.20(P23)
Iset1: R24.2 U7.1(ISET)
Iset2: U5.1(ISET)
Iset3: U4.1(ISET)
Iset4: R28.2 U9.1(ISET)
MISO: U2.9(MISO) U11.16(DATA_OUT) U12.16(DATA_OUT)
MOSI: U11.17(DATA_INPUT) U12.17(DATA_INPUT)
NRST: C26.2 KEY2.2 U10.7(NRST)
NSS2: U11.18(I/O_CLOCK)
NSS3: U12.18(I/O_CLOCK)
NSS4: U2.7(SCK)
OSC_In: C16.1 U10.5(PH0-OSC_IN) U13.P$1(PIN1)
OSC_In32: C25.1 U10.3(PC14-OSC32_IN) U20.P$1(PIN1)
OSC_OUT: C17.1 U10.6(PH1-OSC_OUT) U13.P$2(PIN2)
OSC_OUT32: C24.1 U10.4(PC15-OSC32_OUT) U20.P$2(PIN2)
Outs8_1: U30.3(Z) U46.19(S1) U47.17(S1) U48.17(S1) U50.19(S1) U51.17(S1)
Outs8_2: U37.3(Z) U46.20(S2) U47.18(S2) U48.18(S2) U50.20(S2) U51.18(S2)
Outs8_3: U31.3(Z) U46.21(S3) U47.19(S3) U48.19(S3) U50.21(S3) U51.19(S3)
Outs8_4: U38.3(Z) U46.22(S4) U47.20(S4) U48.20(S4) U50.22(S4) U51.20(S4)
Outs8_5: U32.3(Z) U46.23(S5) U47.21(S5) U48.21(S5) U50.23(S5) U51.21(S5)
Outs8_6: U39.3(Z) U46.24(S6) U47.22(S6) U48.22(S6) U50.24(S6) U51.22(S6)
Outs8_7: U33.3(Z) U46.25(S7) U47.23(S7) U48.23(S7) U50.25(S7) U51.23(S7)
Outs8_8: U40.3(Z) U46.26(S8) U47.24(S8) U48.24(S8) U50.26(S8) U51.24(S8)
Outs8_9: U34.3(Z) U46.11(S9) U47.8(S9) U48.8(S9) U50.11(S9) U51.8(S9)
Outs8_10: U41.3(Z) U46.10(S10) U47.7(S10) U48.7(S10) U50.10(S10) U51.7(S10)
Outs8_11: U35.3(Z) U46.9(S11) U47.6(S11) U48.6(S11) U50.9(S11) U51.6(S11)
Outs8_12: U42.3(Z) U46.8(S12) U47.5(S12) U48.5(S12) U50.8(S12) U51.5(S12)
Outs8_13: U36.3(Z) U46.7(S13) U47.4(S13) U48.4(S13) U50.7(S13) U51.4(S13)
Outs8_14: U43.3(Z) U46.6(S14) U47.3(S14) U48.3(S14) U50.6(S14) U51.3(S14)
OutS16_B+: C71.1 D21.1(C) D23.1(C) Q8.3(S2) R51.1
OutS16_B-: C72.2 D22.2(A) D24.2(A) Q8.1(S1) R52.1
OutS16_B/: C71.2 C72.1 L3.1 R49.1
OutS16B+: C69.1 R48.1 U47.29(D)
OutS16B-: U48.29(D)
OutS16B/: U51.29(D)
OutS16V+: R35.1 U46.28(D)
OutS16V-: R34.1 U50.28(D)
p1_en: D1.2(A) R20.2 U4.23(P26)
p2_en: U4.24(P27)
p3_en: U4.25(P28)
p4_en: U4.27(P29)
p5_en: U4.29(P30)
p6_en: U4.31(P31)
p7_en: U9.32(P4)
p8_en: U9.30(P5)
p9_en: U9.28(P6)
p10_en: U9.26(P7)
p11_en: U9.5(P8)
p12_en: U9.7(P9)
p13_en: U9.9(P10)
p14_en: U9.11(P11)
p15_en: U9.6(P12)
p16_en: U9.8(P13)
p17_en: U9.10(P14)
p18_en: D2.2(A) R21.2 U9.12(P15)
PB: C69.2 D18.1(K) D19.1(K) Q5.1(D) Q5.2(D) Q5.5(D) Q5.6(D) Q7.3(D)
PB_E: D16.1(K) R44.2 U9.23(P26)
PC13: C22.2 KEY1.2 R27.1 U10.2(PC13-ANTI_TAMP)
power_switch: C27.2 C48.2 D7.2(A) Q4.3(S) R40.2 RSH.2 U44.8(VBUS)
ps: R29.1 U9.25(P28)
psB: U9.22(P25) U55.6(S)
PWM_Down: U10.13(PA3)
PWM_DOWN: U57.6(S)
PWM_Up: U10.12(PA2)
PWM_UP: U56.6(S)
SPI1_MISO: U6.12(DOUT) U7.4(DOUT) U10.16(PA6)
SPI1_MOSI: U6.14(DIN) U7.34(DIN) U10.17(PA7)
SPI1_NSS: U10.14(PA4)
SPI1_NSS2: U6.15(CS) U7.35(CS#) U10.30(PA9)
SPI1_SCK: U6.16(DCLK) U7.33(SCLK) U10.15(PA5)
SPI2_MISO: U5.4(DOUT) U9.4(DOUT) U10.27(PB14)
SPI2_MOSI: U5.34(DIN) U9.34(DIN) U10.28(PB15)
SPI2_NSS: U10.46(PB9)
SPI2_NSS2: U5.35(CS#) U9.35(CS#) U10.29(PA8)
SPI2_NSS3: U10.42(PB6)
SPI2_SCK: U5.33(SCLK) U9.33(SCLK) U10.21(PB10)
SPI3_CSK: U52.9(CS#)
SPI3_MISO: U4.4(DOUT) U10.40(PB4) U52.1(DOUT)
SPI3_MOSI: U4.34(DIN) U10.41(PB5)
SPI3_NSS: U10.38(PA15)
SPI3_NSS2: U4.35(CS#) U10.10(PA0-WKUP) U10.43(PB7) U52.10(SCLK)
SPI3_SCK: U4.33(SCLK) U10.39(PB3)
SPI4_MISO: U10.32(PA11) U44.4(MISO)
SPI4_MOSI: U10.11(PA1) U44.2(MOSI)
SPI4_NSS: U10.25(PB12)
SPI4_NSS2: U10.45(PB8) U44.1(CS)
SPI4_SCK: U10.26(PB13) U44.5(SCL)
SPI5_MISO: U10.33(PA12)
SPI5_MOSI: U2.6(MOSI) U10.31(PA10)
SPI5_NSS: U10.19(PB1)
SPI5_NSS1: U2.3(CS)
SPI5_NSS2: U10.20(PB2)
SPI5_SCK: U10.18(PB0)
SW_enc: U3.3(SW) U9.18(P21)
SYS_JTCK-SWCLK: U10.37(PA14)
SYS_JTMS-SWD: U10.34(PA13)
t1: C6.1 C7.1 R5.1 R6.2 R7.1 R8.2 R9.1 R10.1 U6.2(CH0)
t2: U6.3(CH1)
t3: U6.4(CH2)
t4: U6.5(CH3)
T_CLK: U2.10(T_CLK)
T_CS: U2.11(T_CS)
T_DIN: U2.12(T_DIN)
T_DO: U2.13(T_DO)
T_IRQ: R1.1 U2.14(T_IRQ) U9.15(P18)
T_IRQ_R: R1.2
tm_busy: R11.1 U6.13(BUSY)
tm_busy_R: R11.2
tm_e: R12.1 U6.7(SHDN) U9.27(P29)
tm_e_R: R12.2
V+1: C8.2 U7.36(V+)
V+2: U5.36(V+)
V+3: U4.36(V+)
V+4: C23.2 U9.36(V+)
V_CAP: C9.2 U10.22(VCAP-1)
v_msr_to_ADC: U45.6(OUT) U52.5(AIN)
v_stab: C37.1 C40.2 R39.1 U45.7(+VS)
Net-(C18-2): C18.2 R26.1
Net-(C22-1): C22.1 R25.2
Net-(C32-1): C32.1 U29.3(C BOOST)
Net-(C32-2): C32.2 D9.4(K) L1.1 U29.1(SW OUT)
Net-(C33-1): C33.1 R34.2 U45.2(-IN)
Net-(C34-2): C34.2 R35.2 U45.3(+IN)
Net-(C44-2): C44.2 U44.6(VS)
Net-(C63-1): C63.1 U52.6(REF)
Net-(C75-1): C75.1 U56.4(A)
Net-(C75-2): C75.2 D23.2(A) Q8.4(G2) R51.2
Net-(C76-1): C76.1 U57.4(A)
Net-(C76-2): C76.2 D24.1(C) Q8.2(G1) R52.2
Net-(D5-1): D5.1(C) D7.1(C) F1.2 Q4.2(D) R26.2 R31.2
Net-(D6-2): D6.2 Q3.1(G) R29.2 R30.2
Net-(D8-1): D8.1(C) Q3.3(D) R32.1
Net-(D18-2): D18.2(A) Q7.2(S) R48.2
Net-(D21-2): D21.2(A) D22.1(C) Q8.5(D2) Q8.6(D2) Q8.7(D1) Q8.8(D1) U54.2
Net-(L3-2): L3.2 R49.2 U54.1
Net-(LED1-1): LED1.1 R13.2
Net-(LED2-1): LED2.1 R14.2
Net-(LED3-1): LED3.1 R15.2
Net-(LED4-1): LED4.1 R16.2
Net-(LED5-1): LED5.1 R17.2
Net-(LED6-1): LED6.1 R18.2
Net-(LED7-1): LED7.1 R19.2
Net-(Q1-1): Q1.1(G) R20.1 R22.2
Net-(Q2-1): Q2.1(G) R21.1 R23.2
Net-(Q4-1): Q4.1(G) R31.1 R32.2
Net-(Q5-3): Q5.3(G) R44.1 R46.2
Net-(Q6-3): Q6.3(G) R45.1 R47.2
Net-(R13-1): R13.1 U8.7(Q7)
Net-(R14-1): R14.1 U8.6(Q6)
Net-(R15-1): R15.1 U8.5(Q5)
Net-(R16-1): R16.1 U8.4(Q4)
Net-(R17-1): R17.1 U8.3(Q3)
Net-(R18-1): R18.1 U8.2(Q2)
Net-(R19-1): R19.1 U8.1(Q1)
Net-(R36-1): R36.1 U45.1(REF)
Net-(R39-2): R39.2 U45.5(SENSE)
Net-(R40-1): R40.1 U44.10(IN+)
Net-(R41-1): R41.1 U44.9(IN-)
Net-(R50-2): R50.2 U55.4(A)
Net-(U55-2): U55.2(GND) U55.3(B0)

Not connected (* = marked no-connect by the designer): C19 1; C47 1 2; C56 1 2; C57 1 2; C68 1 2; D9 1(NC); Q7 1(G); R50 1; U1 1 2; U2 15(SD_CS)* 16(SD_MOSI)* 17(SD_MISO)* 18(SD_SCK)*; U8 9(Q7S) 15(Q0); U10 49(EP); U11 11(AIN9)* 12(AIN10)*; U18 +(5); U25 +(5); U29 5; U30 7(NC)*; U31 7(NC)*; U32 7(NC)*; U33 7(NC)*; U34 7(NC)*; U35 7(NC)*; U36 7(NC)*; U37 7(NC)*; U38 7(NC)*; U39 7(NC)*; U40 7(NC)*; U41 7(NC)*; U42 7(NC)*; U43 7(NC)*; U45 8(NC)*; U46 2(NC)* 3(NC)* 12(GND) 13(NC)* 27(VSS); U47 9(GND) 12(NC)* 13(NC)* 26(NC)* 27(NC)* 28(NC)* 30(NC)* 32(NC)* 33(EP); U48 9(GND) 12(NC)* 13(NC)* 26(NC)* 27(NC)* 28(NC)* 30(NC)* 32(NC)* 33(EP); U50 2(NC)* 3(NC)* 12(GND) 13(NC)* 27(VSS); U51 9(GND) 12(NC)* 13(NC)* 26(NC)* 27(NC)* 28(NC)* 30(NC)* 32(NC)* 33(EP); U53 GND(4) Vin(1) Vout+(3) Vout-(5)

## Notes on the sheet
- Система интерфейса
- Система индикации
- блок коммутатора нагрузки
- Блок контроля входных и выходных параметров
- АЦП Измерения тока
- Измерение тока
- Измерение напряжения на каждом элементе
- АЦП измерения напряжения
- Измерение температуры
- ...
- 18
- АЦП тока сборки
- Блок переключения балансировки
- 4
- Узел переключения p сборки
- Батарея аккумуляторов
- Блок коммутации
- ...
- SW
- SW
- ...
- 14
- SW
- SW
- ...
- 18
- ...
- АЦП датчики температуры
- 18
- ...
- 14
- SW
- SW
- Пассивная балансировка
- sw
- Микроконтроллер с расширителями портов и обвязкой
- SW
- SW
- ...
- 5
- SW
- SW
- sw
- Активная балансировка
- sw
- SW
- SW
- SW
- SW
- sw
- sw
- ...
- 4
- Стабилизация 5В
- Стабилизация 3,3В
- Двухполярный источник питания +/-5V
